# Altium schematic sheet Sheet1.SchDoc
size A; SheetNumber: 1; SheetTotal: 1
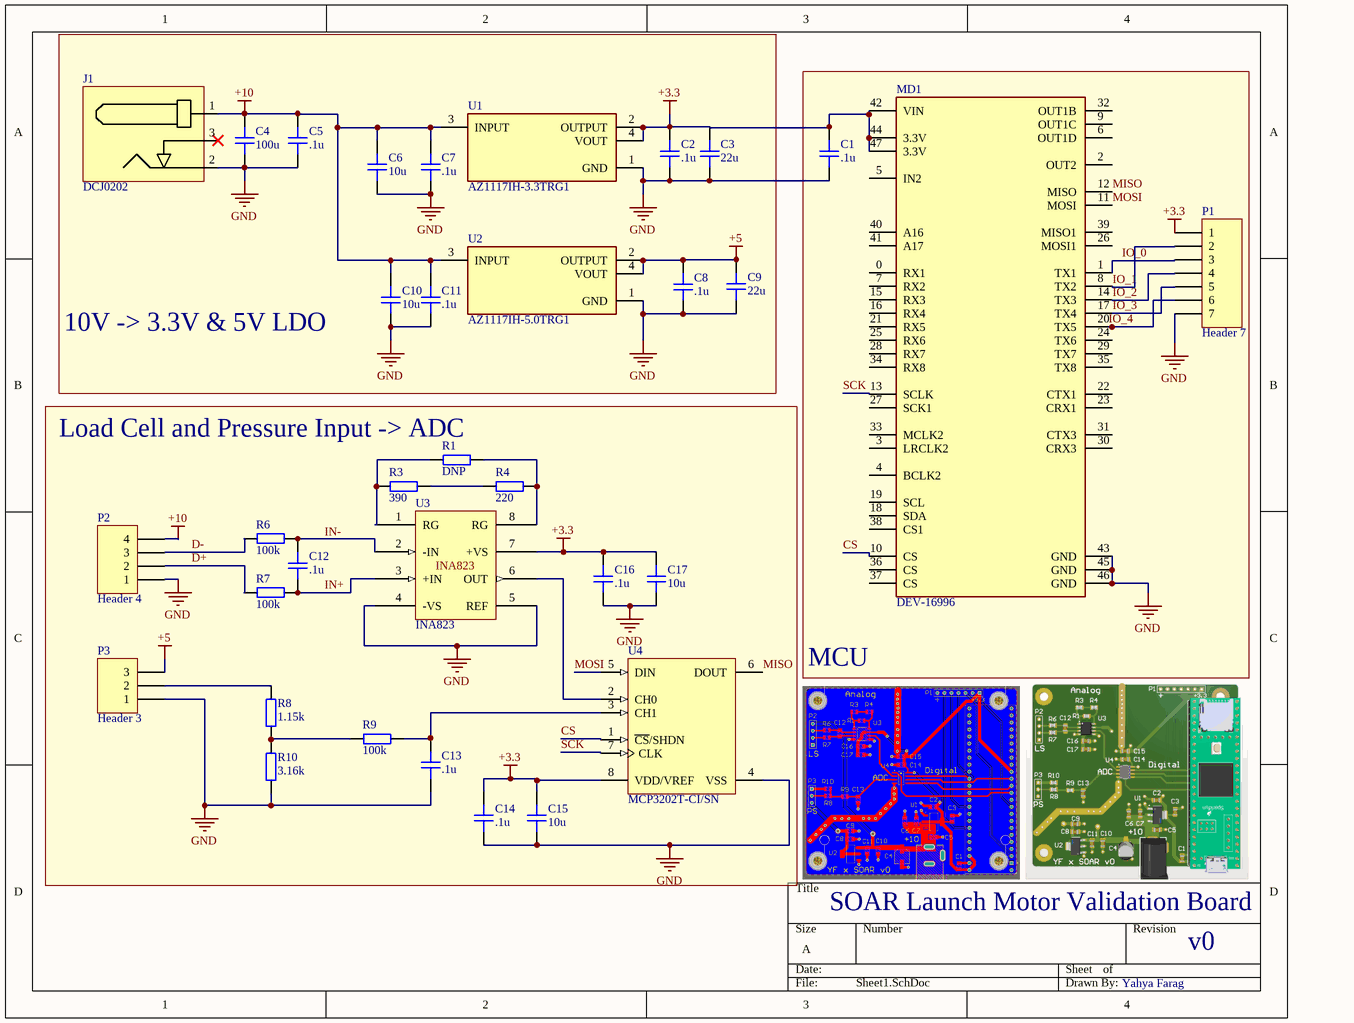
[diagram p0: Sheet1.SchDoc]

## Parts
C1  .1u  [CAP_0805]
C2  .1u  [CAP_0805]
C3  22u  [CAP_0805]
C4  100u  [CAP-EL-NP-5MM]
C5  .1u  [CAP_0805]
C6  10u  [CAP_0805]
C7  .1u  [CAP_0805]
C8  .1u  [CAP_0805]
C9  22u  [CAP_0805]
C10  10u  [CAP_0805]
C11  .1u  [CAP_0805]
C12  .1u  [CAP_0805]
C13  .1u  [CAP_0805]
C14  .1u  [CAP_0805]
C15  10u  [CAP_0805]
C16  .1u  [CAP_0805]
C17  10u  [CAP_0805]
J1  DCJ0202  [DCJ0202]
MD1  DEV-16996  [FP-DEV-16996-MFG]
P1  Header 7  [HDR1X7]
P2  Header 4  [HDR1X4]
P3  Header 3  [HDR1X3]
R1  DNP  [RES_0805]
R3  390  [RES_0805]
R4  220  [RES_0805]
R6  100k  [RES_0805]
R7  100k  [RES_0805]
R8  1.15k  [RES_0805]
R9  100k  [RES_0805]
R10  3.16k  [RES_0805]
U1  AZ1117IH-3.3TRG1  [FP-SOT223-IPC_B]
U2  AZ1117IH-5.0TRG1  [FP-SOT223-IPC_B]
U3  INA823  [SOIC-8]
U4  MCP3202T-CI/SN  [SOIC-SN8_N]

## Blocks framed on the sheet
10V -> 3.3V & 5V LDO: C2-C11 J1 U1 U2
MCU: C1 MD1 P1
Load Cell and Pressure Input -> ADC: C12-C17 P2 P3 R1 R3 R4 R6-R10 U3 U4

## Nets
+3.3: C2.1 C3.1 C14.1 C15.1 C16.1 C17.1 P1.1 U1.2(OUTPUT) U1.4(VOUT) U3.7(+VS) U4.8(VDD/VREF)
+5: C8.1 C9.1 P3.3 U2.2(OUTPUT) U2.4(VOUT)
+10: C4.1 C5.1 C6.1 C7.1 C10.1 C11.1 J1.1 P2.4 U1.3(INPUT) U2.3(INPUT)
GND: C1.2 C2.2 C3.2 C4.2 C5.2 C6.2 C7.2 C8.2 C9.2 C10.2 C11.2 C13.2 C14.2 C15.2 C16.2 C17.2 J1.2 MD1.43(GND) MD1.45(GND) MD1.46(GND) P1.7 P2.1 P3.1 R10.2 U1.1(GND) U2.1(GND) U3.4(-VS) U3.5(REF) U4.4(VSS)
CS: MD1.10(CS) U4.1(~{CS}/SHDN)
D+: P2.2 R7.2
D-: P2.3 R6.2
IN+: C12.2 R7.1 U3.3(+IN)
IO_0: MD1.1(TX1) P1.3
IO_1: MD1.8(TX2) P1.2
IO_2: MD1.14(TX3) P1.4
IO_3: MD1.17(TX4) P1.5
IO_4: MD1.20(TX5) P1.6
MISO: MD1.12(MISO) U4.6(DOUT)
MOSI: MD1.11(MOSI) U4.5(DIN)
SCK: MD1.13(SCLK) U4.7(CLK)
NetC1_1: C1.1 MD1.42(VIN) MD1.44(3.3V) MD1.47(3.3V)
NetC12_1: C12.1 R6.1 U3.2(-IN)
NetC13_1: C13.1 R9.1 U4.3(CH1)
NetP3_2: P3.2 R8.1
NetR1_1: R1.1 R4.1 U3.8(RG)
NetR1_2: R1.2 R3.2 U3.1(RG)
NetR3_1: R3.1 R4.2
NetR8_2: R8.2 R9.2 R10.1
NetU3_6: U3.6(OUT) U4.2(CH0)

Not connected (* = marked no-connect by the designer): J1 3*; MD1 0(RX1) 2(OUT2) 3(LRCLK2) 4(BCLK2) 5(IN2) 6(OUT1D) 7(RX2) 9(OUT1C) 15(RX3) 16(RX4) 18(SDA) 19(SCL) 21(RX5) 22(CTX1) 23(CRX1) 24(TX6) 25(RX6) 26(MOSI1) 27(SCK1) 28(RX7) 29(TX7) 30(CRX3) 31(CTX3) 32(OUT1B) 33(MCLK2) 34(RX8) 35(TX8) 36(CS) 37(CS) 38(CS1) 39(MISO1) 40(A16) 41(A17)

## Notes on the sheet
- SOAR Launch Motor Validation Board
- v0
- Yahya Farag
- Labels drawn without touching a wire or pin: IN-

## Library data of the parts
C1-C3 C5-C17 = CAP_0805_16V: Capacitor SMD 0805 16V
C4 = CAP_EL_NP_5MM: Capacitor SMD Electrolytic Non-Polarised 5mm Diameter - 12V; Manufacturer: Nichicon; Manufacturer Part Number: *
J1 = DCJ0202: DC Barrell Jack 2.1mm 24V 5A THT; Manufacturer: CONEC; Manufacturer Part Number: DCJ0202
MD1 = CMP-157412-000001-1: TEENSY 4.1 (HEADERS)
P1 = Header 7: Header, 7-Pin; LatestRevisionDate: 17-Jul-2002; LatestRevisionNote: Re-released for DXP Platform.; Publisher: Altium Limited
P2 = Header 4: Header, 4-Pin; LatestRevisionDate: 17-Jul-2002; LatestRevisionNote: Re-released for DXP Platform.; Publisher: Altium Limited
P3 = Header 3: Header, 3-Pin; LatestRevisionDate: 17-Jul-2002; LatestRevisionNote: Re-released for DXP Platform.; Publisher: Altium Limited
R1 R3 R4 R6-R10 = RES_0805: Resistor SMD 0805; Manufacturer: *; Manufacturer Part Number: *; Distributor Link: *
U1 = CMP-12756-000043-1: IC REG LINEAR 3.3V 1A SOT223; Output Current: 800mA; Number of Regulators: 1; Dropout Voltage: 1.2V; RoHS Compliant: Yes; Min Current Limit: 1A; Mount: Surface Mount; Packaging: Tape and Reel; Output Voltage: 3.3V; Min Operating Temperature: -40°C; Max Operating Temperature: 125°C; Number of Pins: 3; Case/Package: TO-261-4
U2 = CMP-12756-000043-1: IC REG LINEAR 5.0V 1A SOT223; Output Voltage: 3.3V; Output Current: 800mA; Number of Regulators: 1; Dropout Voltage: 1.2V; RoHS Compliant: Yes; Min Current Limit: 1A; Mount: Surface Mount; Packaging: Tape and Reel; Min Operating Temperature: -40°C; Max Operating Temperature: 125°C; Number of Pins: 3; Case/Package: TO-261-4
U4 = CMP-0188-00478-2: 2.7V Dual Channel 12-Bit A/D Converter with SPI Serial Interface, 8-Pin SOIC 150mil, C Performance Grade, Industrial Temperature, Tape and Reel; ComponentLink2Description: Datasheet; ComponentLink1Description: Manufacturer URL; Code_IPC: SOIC127P600-8; ComponentLink3Description: Package Specification; PackageReference: SOIC-SN8; ComponentLink2URL: http://ww1.microchip.com/downloads/en/DeviceDoc/21034F.pdf; ComponentLink3URL: http://www.microchip.com/stellent/groups/techpub_sg/documents/packagingspec/en012702.pdf; PackageDescription: 8-Lead Plastic Small Outline (SN) - Narrow, 3.90mm Body [SOIC]; ComponentLink1URL: http://www.microchip.com/; PackageVersion: revBB, Aug-2009; Code_JEDEC: MS-012; RevisionNote: URLs added. DatasheetVersion updated.; DatasheetVersion: revF, Nov-2011